# Altium project MedicionCorrientesBias.PrjPcb
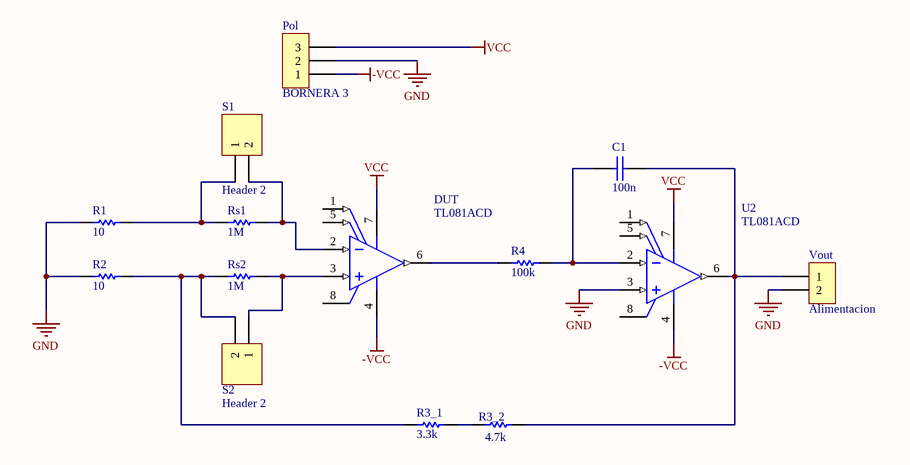
[diagram p0: esquematico.SchDoc]
1 sheet, 14 parts. Net scope: global (net labels, ports and power ports of the same name join across sheets).
Board file: PCB.PcbDoc

## Sheet esquematico.SchDoc
size A

### Parts
C1  100n  [CAP200]
DUT  TL081ACD  [DIP8]
Pol  BORNERA 3  [BORNERA3]
R1  10  [RES300]
R2  10  [RES300]
R3_1  3.3k  [RES300]
R3_2  4.7k  [RES300]
R4  100k  [RES300]
Rs1  1M  [RES300]
Rs2  1M  [RES300]
S1  Header 2  [HDR1X2]
S2  Header 2  [HDR1X2]
U2  TL081ACD  [DIP8]
Vout  Alimentacion  [BORNERA2]

### Nets
-VCC: DUT.4(VCC-) Pol.1 U2.4(VCC-)
GND: Pol.2 R1.1 R2.1 U2.3(IN+) Vout.2
VCC: DUT.7(VCC+) Pol.3 U2.7(VCC+)
NetC1_1: C1.1 R4.2 U2.2(IN-)
NetC1_2: C1.2 R3_2.2 U2.6(OUT) Vout.1
NetDUT_2: DUT.2(IN-) Rs1.2 S1.2
NetDUT_3: DUT.3(IN+) Rs2.2 S2.1
NetDUT_6: DUT.6(OUT) R4.1
NetR1_2: R1.2 Rs1.1 S1.1
NetR2_2: R2.2 R3_1.1 Rs2.1 S2.2
NetR3_1_2: R3_1.2 R3_2.1

Not connected (* = marked no-connect by the designer): DUT 1(OFFSET_N1) 5(OFFSET_N2) 8(NC); U2 1(OFFSET_N1) 5(OFFSET_N2) 8(NC)

### Library data of the parts
C1 = CAP
DUT U2 = TL081ACD: JFET-Input Operational Amplifier, 7 to 36 V, 0 to 70 degC, 8-pin SOIC (D8), Green (RoHS & no Sb/Br); Manufacturer: Texas Instruments; CMRR(Min)(dB): 75; GBW(Typ)(MHz): 3; IIB(Max)(pA): 200; Iq per channel(Max)(mA): 2.8; Number of Channels: 1; Offset Drift(Typ)(uV/C): 18; Rating: Catalog; Slew Rate(Typ)(V/us): 13; Sub Family: General Purpose Amplifier, High Supply Voltage Amplifier (>=30V); Total Supply Voltage(Max)(+5V is 5, +/-5V is 10): 36; Total Supply Voltage(Min)(+5V is 5, +/-5V is 10): 7; Vio (25C)(Max)(mV): 6; DatasheetVersion: SLOS081G; PackageVersion: 4040047-3/M, 06/2011; PackageReference: D8; PackageDescription: 8-Pin Plastic Small Outline, Body 4.9 x 3.9 mm, Pitch 1.27 mm; Supplier 1: Digi-Key; Supplier Part Number 1: 296-7201-5-ND; Supplier 2: Farnell; Supplier Part Number 2: 1459709; Supplier 3: Newark; Supplier Part Number 3: 76C9114; Supplier 4: Mouser; Supplier Part Number 4: 595-TL081ACD; Eco-Plan: Green (RoHS & no Sb/Br); Vn at 1kHz(Typ)(nV/rtHz): 18; Mounting Technology: Surface Mount; Code_JEDEC: MS-012; PartNumber: TL081ACD; ComponentLink1Description: Manufacturer URL; ComponentLink1URL: http://www.ti.com/; ComponentLink2Description: Datasheet; ComponentLink2URL: http://www.ti.com/lit/ds/symlink/tl081a.pdf; ComponentLink3Description: Package Specification; ComponentLink3URL: http://www.ti.com/litv/pdf/msoi002j
R1 R2 R3_1 R3_2 R4 Rs1 Rs2 = RES
S1 S2 = Header 2: Header, 2-Pin; LatestRevisionDate: 17-Jul-2002; LatestRevisionNote: Re-released for DXP Platform.; Publisher: Altium Limited
Vout = BORNERA 2